# EAGLE design 1206PTC-TO252 (EAGLE 7.3.0)
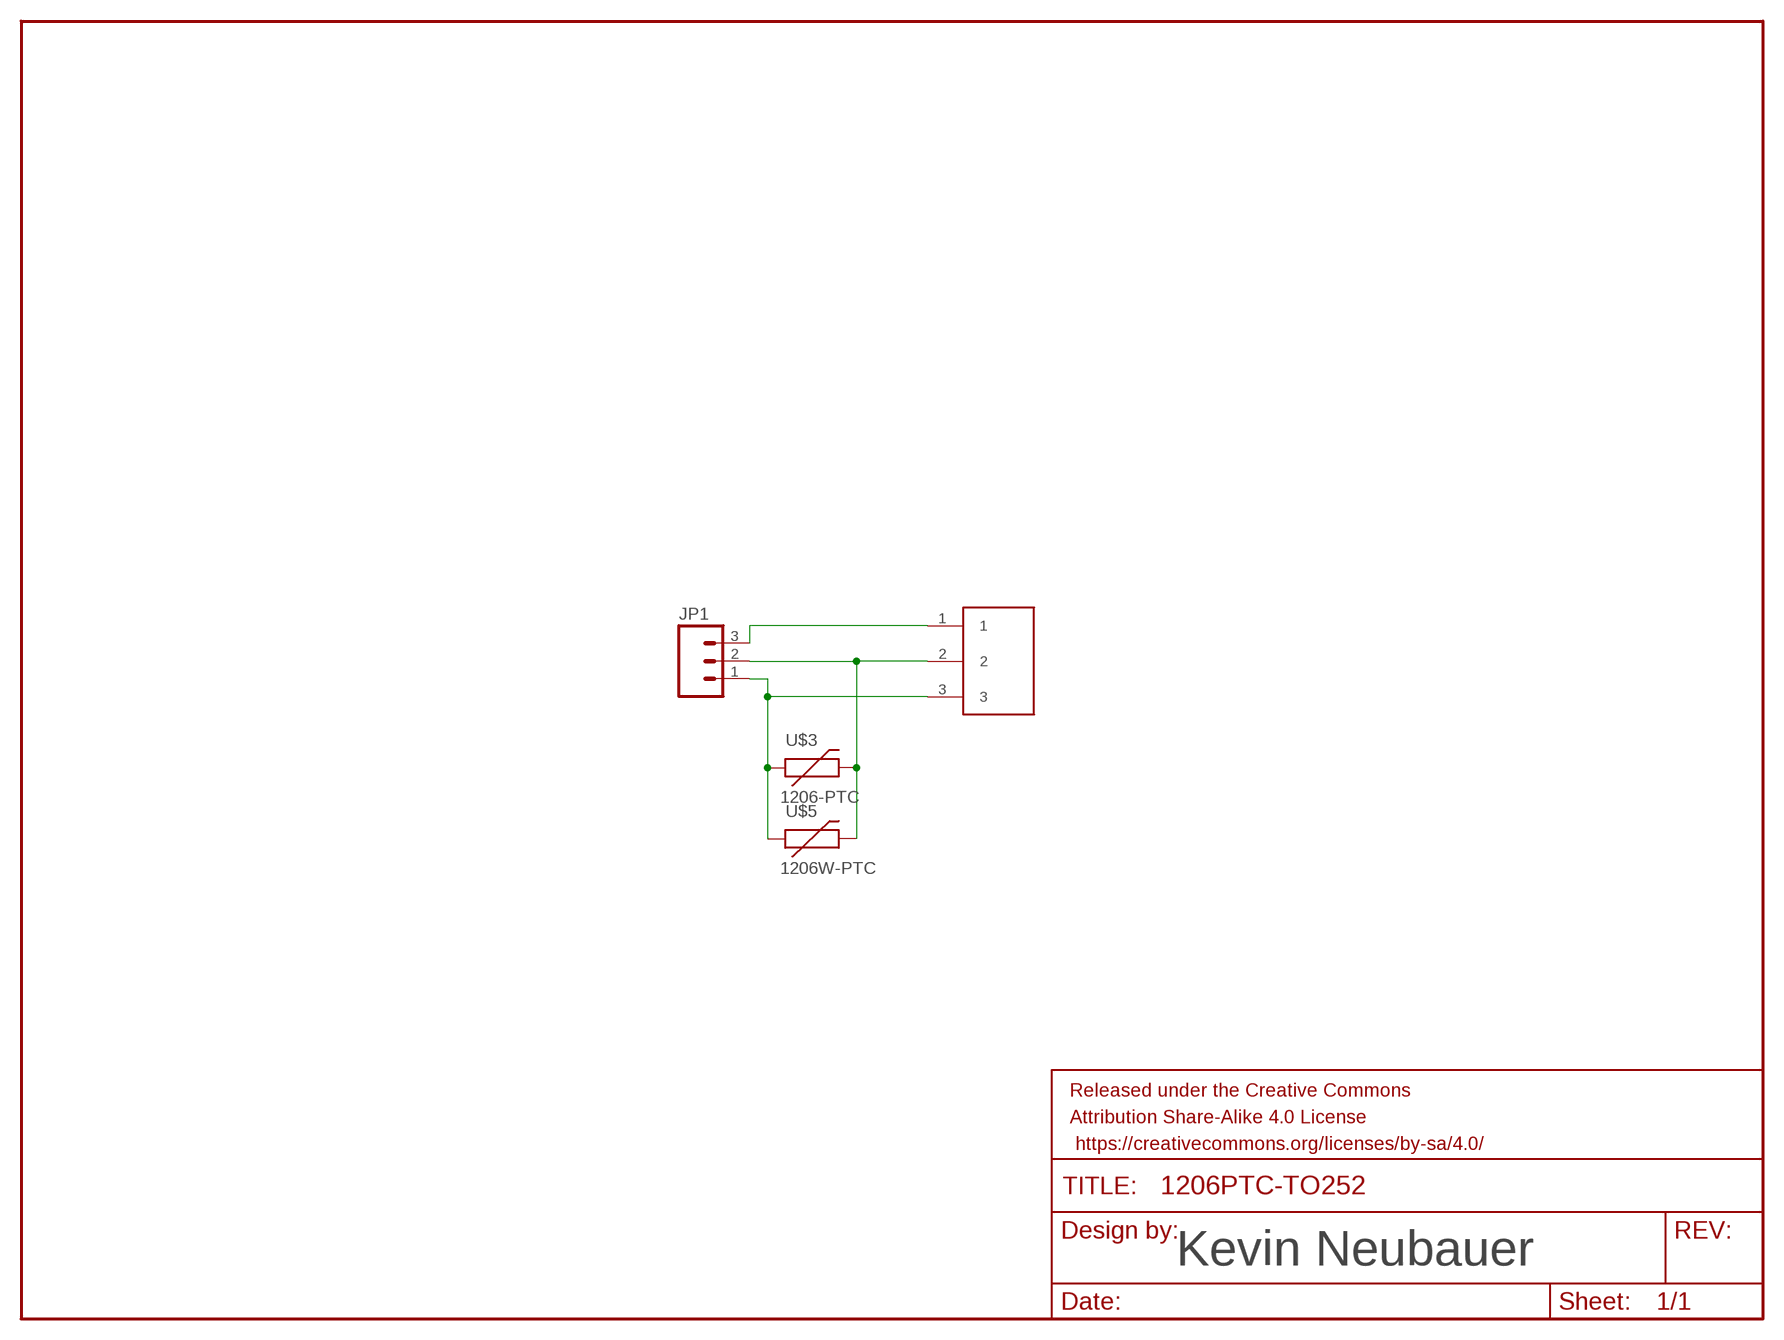
[diagram p0: schematic, sheet 1]

## Parts
FRAME1  FRAME-LETTER  [CREATIVE_COMMONS]
JP1  M03PTH  [1X03]
U$3  1206-PTC  [PTC-1206]
U$4  DPAK  [DPAK]
U$5  1206W-PTC  [PTC-1206-WIDE]

## Nets
N$1: JP1.1 U$3.1 U$4.3 U$5.1
N$2: JP1.2 U$3.2 U$4.2 U$5.2
N$3: JP1.3 U$4.1

## Notes on the sheet
- Kevin Neubauer

## Library data of the parts
FRAME1 = SparkFun-Aesthetics:FRAME-LETTER: Schematic Frame Standard 8.5x11 US Letter frame
JP1 = SparkFun-Connectors:M03: Header 3 Standard 3-pin 0.1" header. Use with straight break away headers (SKU : PRT-00116), right angle break away headers (PRT-00553), swiss pins (PRT-00743), machine pins (PRT-00117), and female headers (PRT-00115). Molex polarized connector foot print use with SKU : PRT-08232 with associated crimp pins and housings.
U$3 = Kevin-GenericICFootprints:1206-PTC
U$4 = Kevin-GenericICFootprints:DPAK
U$5 = Kevin-GenericICFootprints:1206W-PTC

## Board
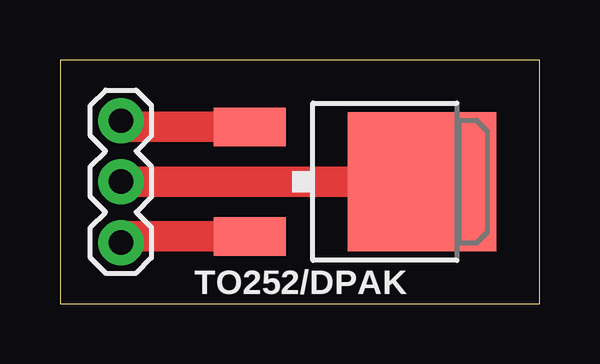
[diagram p1: board, top side]
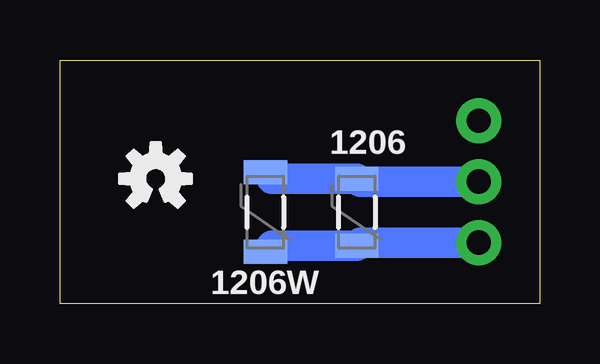
[diagram p2: board, bottom side, seen from below]

Size 19.99 x 10.15 mm. Coordinates in mm from the lower left corner, seen from the top.
Outline: 0,0 19.99,0 19.99,10.15 0,10.15 0,0
Copper layers (1*16): Top 0.0356mm / dielectric 1.5011mm / Bottom 0.0356mm
Design rules "OSH Park": minimum track width 6mil, minimum drill 13mil, track to track 6mil, track to pad 6mil, pad to pad 6mil, via to via 6mil, smd to smd 6mil, copper to edge 15mil, drill to drill 6mil, minimum pad ring 7mil, minimum via ring 7mil, stop-mask expansion 3mil, vias tented up to drill 0mil, thermal gap 10mil

### Footprints (pad centres in the part's own frame; a part is rotated, then mirrored left to right if it is on the bottom)
1X03 = drill 1.016 pad 1.88: 1 0,0; 2 2.54,0; 3 5.08,0
PTC-1206 = smd 1 x 1.8: 1 -1.4,0; 2 1.4,0
DPAK = smd 1.6 x 3: 1 -2.28,-6.07; 3 2.28,-6.07 | smd 5.8 x 6.2: 2 0,1.11
PTC-1206-WIDE = smd 1 x 1.8: 1 -1.654,0; 2 1.654,0

### Placement (x,y rotation side)
FRAME1  -6.1,-9.14 0 top  (outside the outline)
JP1  2.54,2.54 90 top
U$2  [OSHW-LOGO-S]  16,5.21 0 bottom
U$3  7.62,3.81 90 bottom
U$4  13.97,5.08 270 top
U$5  11.43,3.81 90 bottom

### Tracks (layer width: path | path; a pad name or v marks a point on that pad's centre or on a via)
N$1
  Top 0.61: 2.8,2.8 JP1.1
  Top 1.27: U$4.3 2.8,2.8
  Bottom 0.254: 7.49,2.54 U$3.1 | 11.18,2.41 U$5.1
  Bottom 1.27: JP1.1 7.49,2.54 | U$3.1 11.18,2.41
N$2
  Top 1.27: U$4.2 JP1.2
  Bottom 0.254: 7.49,5.08 U$3.2 | 11.18,5.21 U$5.2
  Bottom 1.27: JP1.2 7.49,5.08 | U$3.2 11.18,5.21
N$3
  Top 0.61: 2.8,7.36 JP1.3
  Top 1.27: U$4.1 2.8,7.36

### Text on the board
tNames: TO252/DPAK
bNames: 1206 | 1206W
tDocu: Kevin Neubauer